# EAGLE design SHT Test Module (EAGLE 8.4.0)
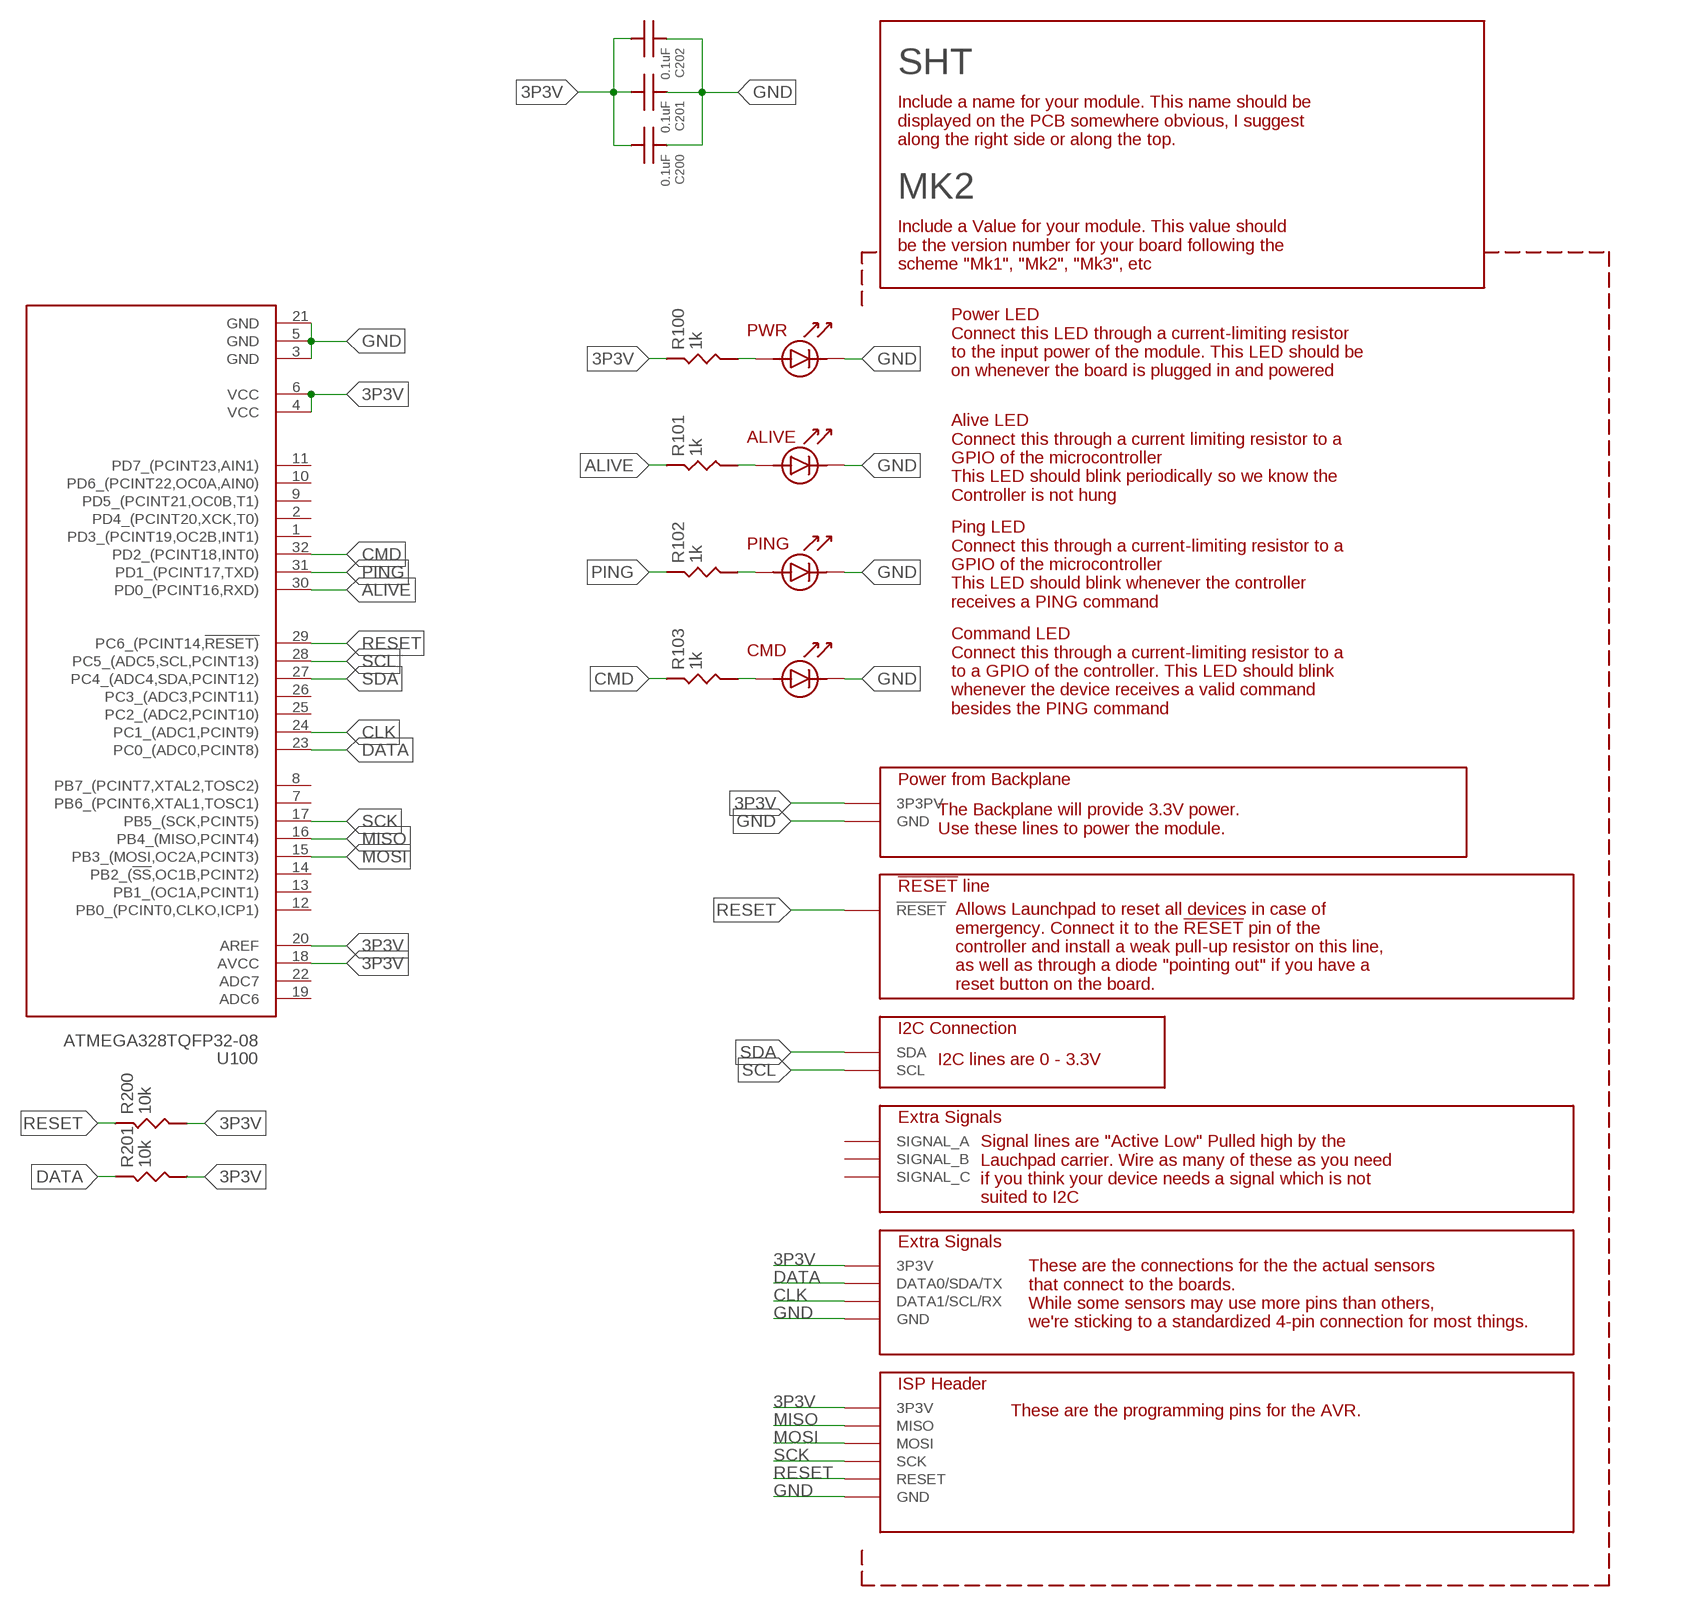
[diagram p0: schematic, sheet 1]

## Parts
C200  0.1uF  CAPACITOR-UNPOLARIZED0805  [0805_STACKPOLERESISTOR]
C201  0.1uF  CAPACITOR-UNPOLARIZED0805  [0805_STACKPOLERESISTOR]
C202  0.1uF  CAPACITOR-UNPOLARIZED0805  [0805_STACKPOLERESISTOR]
R100  1k  RESISTOR  [0805_STACKPOLERESISTOR]
R101  1k  RESISTOR  [0805_STACKPOLERESISTOR]
R102  1k  RESISTOR  [0805_STACKPOLERESISTOR]
R103  1k  RESISTOR  [0805_STACKPOLERESISTOR]
R200  10k  RESISTOR  [0805_STACKPOLERESISTOR]
R201  10k  RESISTOR  [0805_STACKPOLERESISTOR]
SHT  MK2  SENSOR_MODULE_MK1  [SENSOR_MODULE_MK1]
U100  ATMEGA328TQFP32-08  [TQFP32-08]

## Nets
3P3V: C200.P$2 C201.P$2 C202.P$2 R100.P$1 R200.P$2 R201.P$2 SHT.3P3V@1(3P3PV) SHT.3P3V@2(3P3V) SHT.3P3V@3(3P3V) SHT.3P3V@4(3P3V) U100.4(VCC) U100.6(VCC) U100.18(AVCC) U100.20(AREF)
ALIVE: R101.P$1 U100.30(PD0_(PCINT16,RXD))
CLK: SHT.DATA1@1(DATA1/SCL/RX) SHT.DATA1@2(DATA1/SCL/RX) U100.24(PC1_(ADC1,PCINT9))
CMD: R103.P$1 U100.32(PD2_(PCINT18,INT0))
DATA: R201.P$1 SHT.DATA0@1(DATA0/SDA/TX) SHT.DATA0@2(DATA0/SDA/TX) U100.23(PC0_(ADC0,PCINT8))
GND: C200.P$1 C201.P$1 C202.P$1 SHT.ALIVELED_CATHODE SHT.CMDLED_CATHODE SHT.GND@1(GND) SHT.GND@2(GND) SHT.GND@3(GND) SHT.GND@4(GND) SHT.PINGLED_CATHODE SHT.PWRLED_CATHODE U100.3(GND) U100.5(GND) U100.21(GND)
MISO: SHT.MISO U100.16(PB4_(MISO,PCINT4))
MOSI: SHT.MOSI U100.15(PB3_(MOSI,OC2A,PCINT3))
N$12: R100.P$2 SHT.PWRLED_ANODE
N$13: R101.P$2 SHT.ALIVELED_ANODE
N$14: R102.P$2 SHT.PINGLED_ANODE
N$15: R103.P$2 SHT.CMDLED_ANODE
PING: R102.P$1 U100.31(PD1_(PCINT17,TXD))
RESET: R200.P$1 SHT.RESET@1(!RESET) SHT.RESET@2(RESET) U100.29(PC6_(PCINT14,!RESET))
SCK: SHT.SCK U100.17(PB5_(SCK,PCINT5))
SCL: SHT.SCL U100.28(PC5_(ADC5,SCL,PCINT13))
SDA: SHT.SDA U100.27(PC4_(ADC4,SDA,PCINT12))
Unconnected: SHT.A(SIGNAL_A) SHT.B(SIGNAL_B) SHT.C(SIGNAL_C) U100.1(PD3_(PCINT19,OC2B,INT1)) U100.2(PD4_(PCINT20,XCK,T0)) U100.7(PB6_(PCINT6,XTAL1,TOSC1)) U100.8(PB7_(PCINT7,XTAL2,TOSC2)) U100.9(PD5_(PCINT21,OC0B,T1)) U100.10(PD6_(PCINT22,OC0A,AIN0)) U100.11(PD7_(PCINT23,AIN1)) U100.12(PB0_(PCINT0,CLKO,ICP1)) U100.13(PB1_(OC1A,PCINT1)) U100.14(PB2_(!SS,OC1B,PCINT2)) U100.19(ADC6) U100.22(ADC7) U100.25(PC2_(ADC2,PCINT10)) U100.26(PC3_(ADC3,PCINT11))

## Library data of the parts
C200-C202 = 000_CustomPartsMaster:CAPACITOR-UNPOLARIZED
R100-R103 R200 R201 = 000_CustomPartsMaster:RESISTOR
SHT = 000_CustomPartsMaster:SENSOR_MODULE_MK1
U100 = 000_CustomPartsMaster:ATMEGA328

## Board
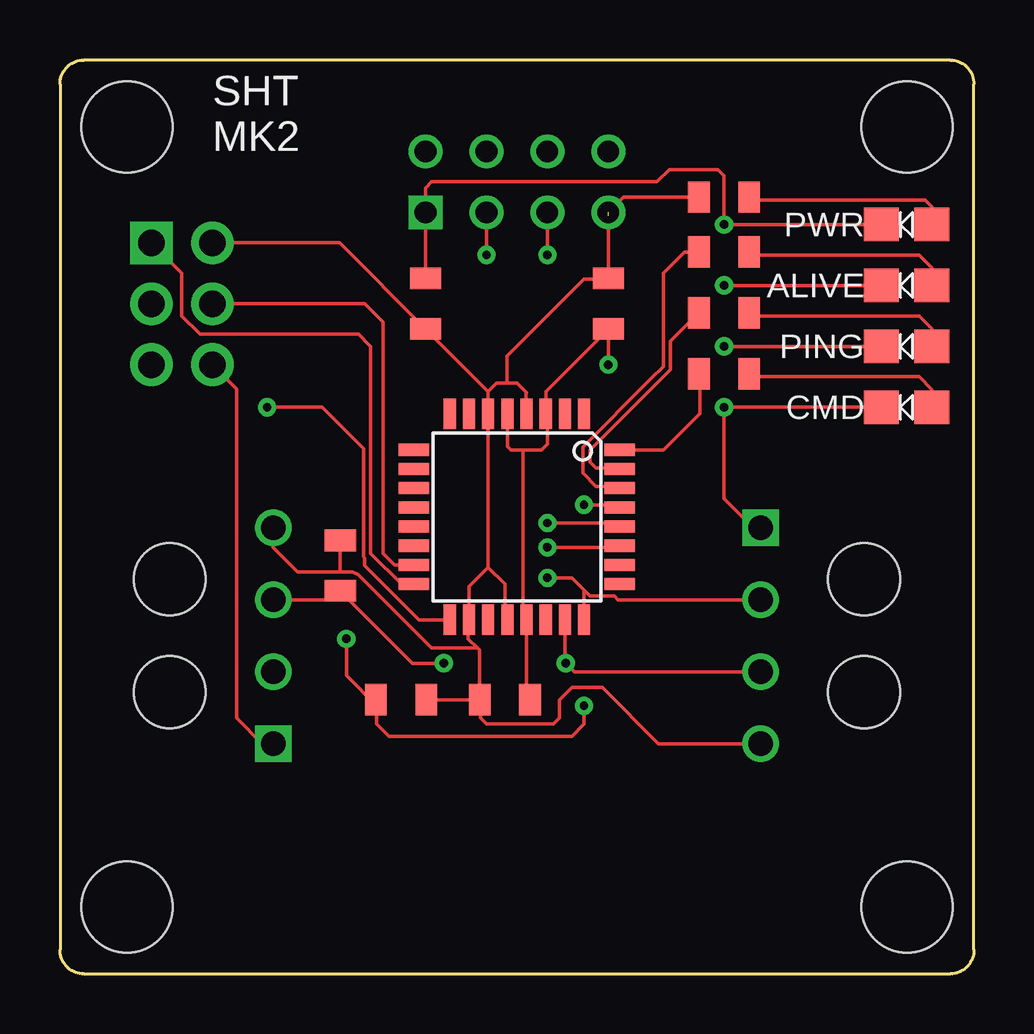
[diagram p1: board, top side]
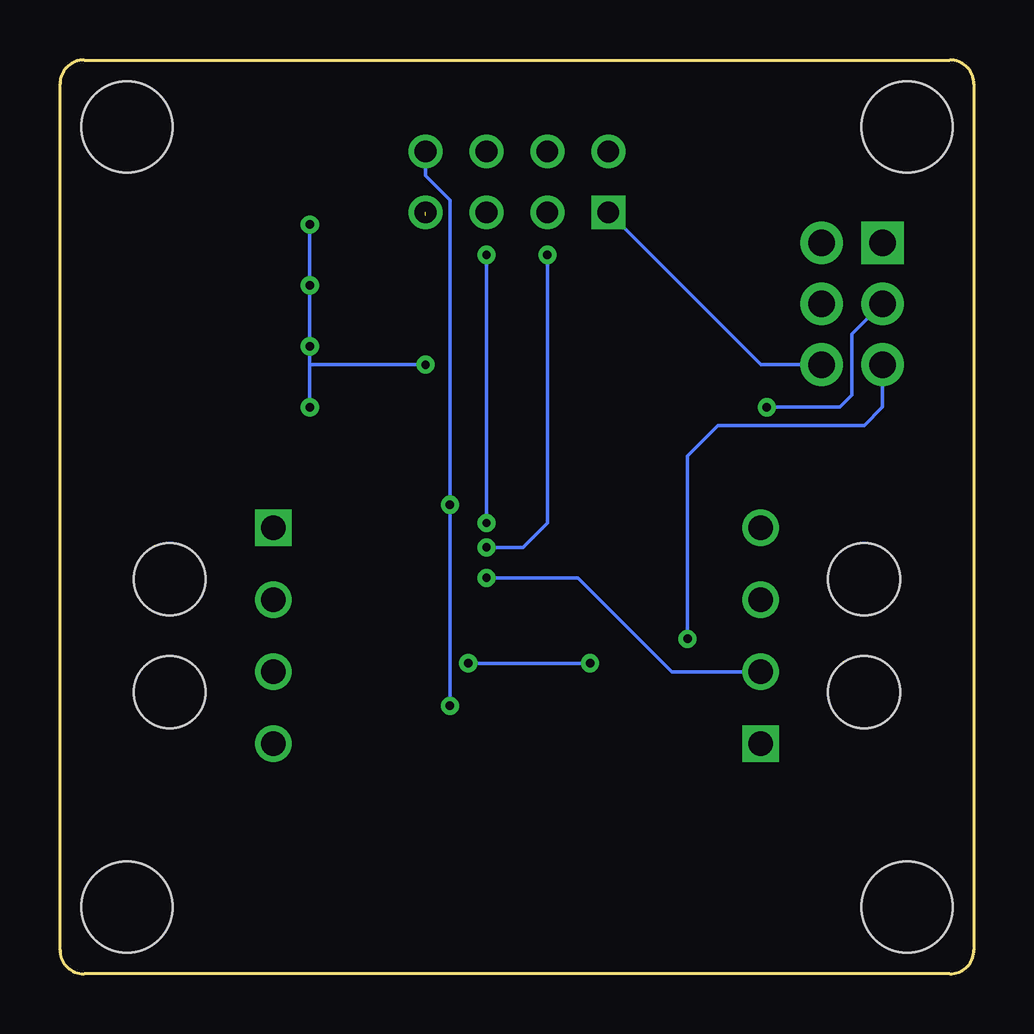
[diagram p2: board, bottom side, seen from below]

Size 38.1 x 38.1 mm. Coordinates in mm from the lower left corner, seen from the top.
Copper layers (1*16): Top 0.035mm / dielectric 1.5mm / Bottom 0.035mm
Design rules "default": minimum track width 6mil, minimum drill 0.35mm, track to track 6mil, track to pad 6mil, pad to pad 6mil, via to via 6mil, smd to smd 6mil, copper to edge 40mil, drill to drill 6mil, minimum pad ring 10mil, minimum via ring 8mil, stop-mask expansion 4mil, vias tented up to drill 0mil, thermal gap 10mil

### Footprints (pad centres in the part's own frame; a part is rotated, then mirrored left to right if it is on the bottom)
0805_STACKPOLERESISTOR = smd 0.9 x 1.3: P$1 -1.05,0; P$2 1.05,0
SENSOR_MODULE_MK1 = drill 0.9: 3P3V@1 22.86,31.75; A 20.32,34.29; B 17.78,34.29; C 15.24,34.29; RESET@1 22.86,34.29; SCL 20.32,31.75; SDA 17.78,31.75 | drill 1.02: 3P3V@2 8.892,18.597; 3P3V@3 29.208,9.597; DATA0@1 8.892,15.597; DATA0@2 29.208,12.597; DATA1@1 8.892,12.597; DATA1@2 29.208,15.597 | drill 1.1 pad 1.778: 3P3V@4 6.35,30.48; GND@4 6.35,25.4; MOSI 6.35,27.94; RESET@2 3.81,25.4; SCK 3.81,27.94 | smd 1.45 x 1.4: ALIVELED_ANODE 36.343,28.702; ALIVELED_CATHODE 34.243,28.702; CMDLED_ANODE 36.343,23.622; CMDLED_CATHODE 34.243,23.622; PINGLED_ANODE 36.343,26.162; PINGLED_CATHODE 34.243,26.162; PWRLED_ANODE 36.343,31.242; PWRLED_CATHODE 34.243,31.242 | drill 0.9 square: GND@1 15.24,31.75 | drill 1.02 square: GND@2 8.892,9.597; GND@3 29.208,18.597 | drill 1.1 pad 1.778 square: MISO 3.81,30.48 | hole 3.797: 2.794,2.794; 35.306,2.794; 2.794,35.306; 35.306,35.306 | hole 3: 4.572,11.747; 4.572,16.447; 33.528,16.447; 33.528,11.747
TQFP32-08 = smd 1.27 x 0.508: 1 -4.293,2.8; 2 -4.293,2; 3 -4.293,1.2; 4 -4.293,0.4; 5 -4.293,-0.4; 6 -4.293,-1.2; 7 -4.293,-2; 8 -4.293,-2.8; 17 4.293,-2.8; 18 4.293,-2; 19 4.293,-1.2; 20 4.293,-0.4; 21 4.293,0.4; 22 4.293,1.2; 23 4.293,2; 24 4.293,2.8 | smd 0.508 x 1.27: 9 -2.8,-4.293; 10 -2,-4.293; 11 -1.2,-4.293; 12 -0.4,-4.293; 13 0.4,-4.293; 14 1.2,-4.293; 15 2,-4.293; 16 2.8,-4.293; 25 2.8,4.293; 26 2,4.293; 27 1.2,4.293; 28 0.4,4.293; 29 -0.4,4.293; 30 -1.2,4.293; 31 -2,4.293; 32 -2.8,4.293

### Placement (x,y rotation side)
C200  18.54,11.43 180 top
C201  15.24,27.94 270 top
C202  22.86,27.94 90 top
R100  27.69,32.38 0 top
R101  27.69,30.1 0 top
R102  27.69,27.56 0 top
R103  27.69,25.02 0 top
R200  14.22,11.43 0 top
R201  11.68,17.02 90 top
SHT  0,0 0 top
U100  19.05,19.05 270 top

### Tracks (layer width: path | path; a pad name or v marks a point on that pad's centre or on a via)
3P3V  (1 unrouted)
  Top 0.152: 17.84,24.29 C201.P$2 11.65,30.48 SHT.3P3V@4 | 17.84,24.29 17.85,24.28 U100.6 17.85,16.95 | 22.86,31.61 C202.P$2 22.83,28.96 21.84,28.96 18.63,25.75 18.63,24.64 | 19.45,24.24 19.43,24.26 | 19.43,24.26 19.05,24.64 18.63,24.64 | 17.84,24.29 18.2,24.64 18.63,24.64 | 19.43,24.26 19.43,23.36 U100.4 | SHT.3P3V@1 23.5,32.38 R100.P$1 | R200.P$2 C200.P$2 | SHT.3P3V@3 24.95,9.6 22.61,11.94 21.34,11.94 20.83,11.43 20.83,10.67 20.57,10.41 17.78,10.41 17.53,10.67 17.53,11.4 C200.P$2 | 17.85,16.95 18.54,16.26 18.54,14.87 U100.20 | 17.85,16.95 17.05,16.15 U100.18 17.02,14.72 17.02,13.97 17.4,13.59 | C200.P$2 17.49,13.5 17.4,13.59 | SHT.3P3V@2 8.89,17.78 9.91,16.76 11.68,16.76 | 11.68,16.76 12.19,16.76 12.44,16.65 12.43,16.65 15.49,13.59 17.4,13.59 | R201.P$2 11.68,16.76
ALIVE
  Top 0.152: R101.P$1 26.04,30.1 25.15,29.21 25.15,25.32 24.64,24.82 24.55,24.73 21.79,21.97 21.79,20.88 22.35,20.32 23.27,20.32 U100.30
CLK  (via drill 0.35)
  Top 0.152: U100.24 21.85,16 | 21.85,16 21.34,16.51 v20.32,16.51 | 21.85,16 22.1,15.75 23.11,15.75 23.27,15.6 SHT.DATA1@2
  Bottom 0.152: v20.32,16.51 16.51,16.51 12.6,12.6 SHT.DATA1@1
CMD
  Top 0.152: U100.32 25.15,21.85 26.67,23.37 26.67,24.98 R103.P$1
DATA  (via drill 0.35)
  Top 0.152: SHT.DATA0@1 11.31,15.6 R201.P$1 14.7,12.95 v16,12.95 | U100.23 21.05,12.99 v21.08,12.95 21.44,12.6 SHT.DATA0@2
  Bottom 0.152: v16,12.95 v21.08,12.95
GND  (via drill 0.35)
  Top 0.152: C201.P$1 SHT.GND@1 15.24,32.77 15.49,33.02 24.89,33.02 25.4,33.53 27.43,33.53 27.69,33.27 v27.69,31.24 SHT.PWRLED_CATHODE | U100.5 18.65,21.99 18.8,21.84 19.3,21.84 | 19.3,21.84 20.07,21.84 20.32,22.1 20.32,23.27 U100.3 20.25,24.28 C202.P$1 v22.86,25.4 | C200.P$1 19.45,11.57 U100.21 19.3,14.9 19.3,16.51 19.3,21.84 | SHT.ALIVELED_CATHODE v27.69,28.7 | v27.69,26.16 SHT.PINGLED_CATHODE | SHT.CMDLED_CATHODE v27.69,23.62 27.69,19.81 28.9,18.6 SHT.GND@3 | SHT.GND@2 8.44,9.6 7.37,10.67 7.37,24.38 SHT.GND@4
  Bottom 0.152: v27.69,31.24 v27.69,28.7 v27.69,26.16 27.69,25.37 | 27.69,25.37 v27.69,23.62 | v22.86,25.4 27.66,25.4 27.69,25.37 | SHT.GND@1 8.89,25.4 SHT.GND@4
MISO
  Top 0.152: U100.16 14.23,16.25 12.95,17.53 12.95,26.16 12.45,26.67 5.84,26.67 5.08,27.43 5.08,29.21 SHT.MISO
MOSI
  Top 0.152: U100.15 13.94,17.05 13.46,17.53 13.46,27.18 12.7,27.94 SHT.MOSI
N$12
  Top 0.152: R100.P$2 28.86,32.26 36.07,32.26 36.34,31.98 SHT.PWRLED_ANODE
N$13
  Top 0.152: 28.86,29.97 R101.P$2 28.86,29.97 | 28.86,29.97 35.81,29.97 36.34,29.44 SHT.ALIVELED_ANODE
N$14
  Top 0.152: R102.P$2 28.86,27.43 35.81,27.43 36.34,26.9 SHT.PINGLED_ANODE
N$15
  Top 0.152: R103.P$2 28.86,24.89 35.81,24.89 36.34,24.36 SHT.CMDLED_ANODE
PING
  Top 0.152: U100.31 23.31,21.08 22.35,21.08 22.1,21.34 22.1,21.84 25.45,25.2 25.45,26.37 R102.P$1
RESET  (via drill 0.35)
  Top 0.152: 13.21,11.18 13.21,11.4 R200.P$1 | 13.21,11.18 13.21,10.41 13.72,9.91 21.34,9.91 21.84,10.41 v21.84,11.18 | v11.94,13.97 11.94,12.45 13.21,11.18 | U100.29 23.23,19.56 v21.84,19.56
  Bottom 0.152: SHT.RESET@1 22.86,33.27 21.84,32.26 v21.84,19.56 v21.84,11.18 | SHT.RESET@2 3.81,23.62 4.57,22.86 10.67,22.86 11.94,21.59 v11.94,13.97
SCK  (via drill 0.35)
  Top 0.152: U100.17 14.96,14.76 12.7,17.02 12.7,17.35 12.65,17.4 12.65,21.89 10.92,23.62 v8.64,23.62
  Bottom 0.152: v8.64,23.62 5.59,23.62 5.08,24.13 5.08,26.67 SHT.SCK
SCL  (via drill 0.35)
  Top 0.152: SHT.SCL v20.32,29.97 | v20.32,18.8 23.2,18.8 U100.28
  Bottom 0.152: v20.32,29.97 v20.32,18.8
SDA  (via drill 0.35)
  Top 0.152: SHT.SDA v17.78,29.97 | v20.32,17.78 23.27,17.78 U100.27
  Bottom 0.152: v17.78,29.97 17.78,18.8 18.8,17.78 v20.32,17.78